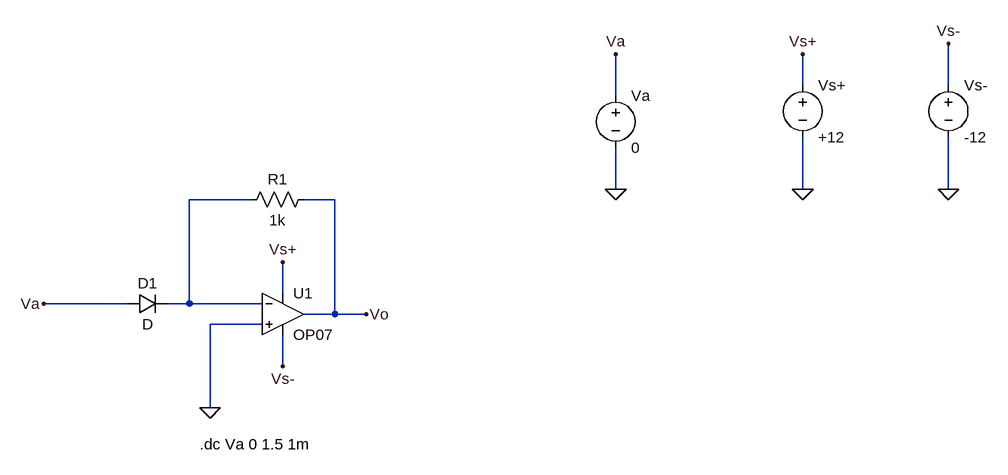
[diagram p0: schematic exp5.asc]
exp5.asc, the LTspice schematic file:
Version 4
SHEET 1 1720 680
WIRE 1184 -112 1184 -160
WIRE 1408 -112 1408 -176
WIRE 896 -96 896 -160
WIRE 896 48 896 -16
WIRE 1184 48 1184 -32
WIRE 1408 48 1408 -32
WIRE 336 64 240 64
WIRE 464 64 416 64
WIRE 384 208 384 160
WIRE 144 224 16 224
WIRE 240 224 240 64
WIRE 240 224 208 224
WIRE 352 224 240 224
WIRE 464 240 464 64
WIRE 464 240 416 240
WIRE 512 240 464 240
WIRE 352 256 272 256
WIRE 384 320 384 272
WIRE 272 384 272 256
FLAG 896 48 0
FLAG 1184 48 0
FLAG 1408 48 0
FLAG 384 160 Vs+
FLAG 384 320 Vs-
FLAG 512 240 Vo
FLAG 896 -160 Va
FLAG 1184 -160 Vs+
FLAG 1408 -176 Vs-
FLAG 272 384 0
FLAG 16 224 Va
SYMBOL OpAmps\\OP07 384 176 R0
SYMATTR InstName U1
SYMBOL voltage 1184 -128 R0
SYMATTR InstName Vs+
SYMATTR Value +12
SYMBOL voltage 1408 -128 R0
SYMATTR InstName Vs-
SYMATTR Value -12
SYMBOL voltage 896 -112 R0
WINDOW 123 0 0 Left 0
WINDOW 39 0 0 Left 0
SYMATTR InstName Va
SYMATTR Value 0
SYMBOL diode 144 240 R270
WINDOW 0 32 32 VTop 2
WINDOW 3 0 32 VBottom 2
SYMATTR InstName D1
SYMBOL res 432 48 R90
WINDOW 0 0 56 VBottom 2
WINDOW 3 32 56 VTop 2
SYMATTR InstName R1
SYMATTR Value 1k
TEXT 256 440 Left 2 !.dc Va 0 1.5 1m

The netlist it stands for:
* exp5.asc
XU1 0 N001 Vs+ Vs- Vo LT1001  ; OP07, pins In+ In- V+ V- OUT
Vs+ Vs+ 0 +12
Vs- Vs- 0 -12
Va Va 0 0
D1 Va N001 D
R1 Vo N001 1k
.model D D
.lib standard.dio
.dc Va 0 1.5 1m
.lib LTC.lib
.backanno
.end

* Results of the author's LTspice run, read from the files saved beside the schematic
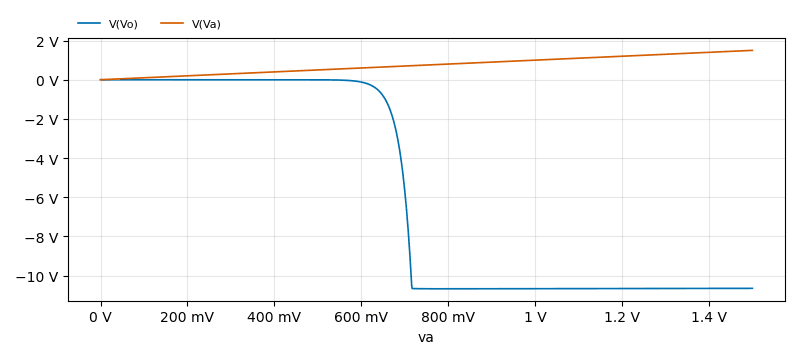
[diagram p1: DC transfer characteristic of exp5.asc, plotted from the saved traces]
* DC transfer characteristic, 1 run:
*   V(Vo): -0.002472 fV at va=0 V, -10.66 V at va=1.5 V, min -10.68 V, max -0.002472 fV
*   V(Va): 0 V at va=0 V, 1.5 V at va=1.5 V, min 0 V, max 1.5 V